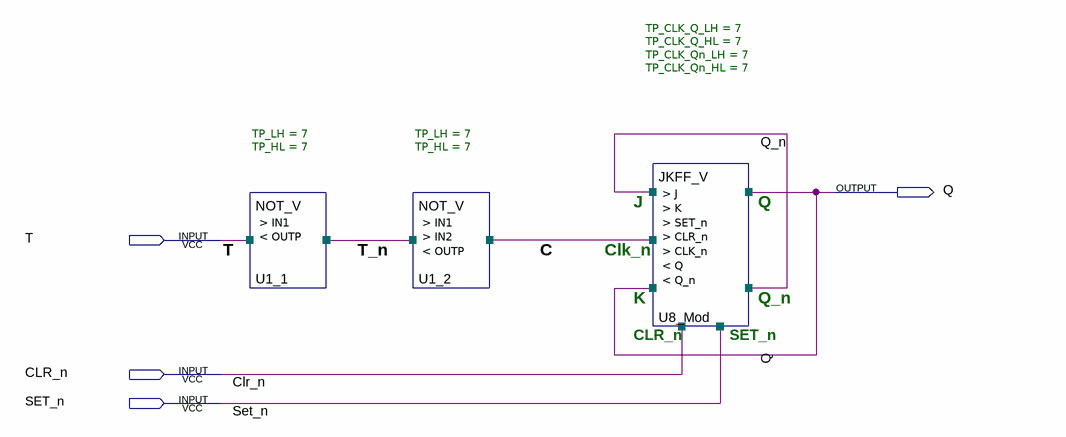
[diagram p0: schematic sheet]
// Quartus schematic ZVH_260_TT.bdf as structural Verilog: 3 symbols, 4 pins
module ZVH_260_TT (
  input  T,
  input  CLR_n,
  input  SET_n,
  output Q
);

  wire C, Q_n, T_n;

  NOT_V #(.TP_LH(7), .TP_HL(7)) U1_1 (.IN1(T), .OUTP(T_n));
  NOT_V #(.TP_LH(7), .TP_HL(7)) U1_2 (.IN1(T_n), .OUTP(C));  // open: IN2
  JKFF_V #(.TP_CLK_Q_LH(7), .TP_CLK_Q_HL(7), .TP_CLK_Qn_LH(7), .TP_CLK_Qn_HL(7)) U8_Mod (
    .J(Q_n), .K(Q), .SET_n(SET_n), .CLR_n(CLR_n), .CLK_n(C), .Q(Q), .Q_n(Q_n));

  // Notes on the sheet:
  //   J
  //   Q
  //   Clk_n
  //   K
  //   Q_n
  //   CLR_n
  //   SET_n
endmodule
